# EAGLE design pastovac_2 (EAGLE 9.6.2)
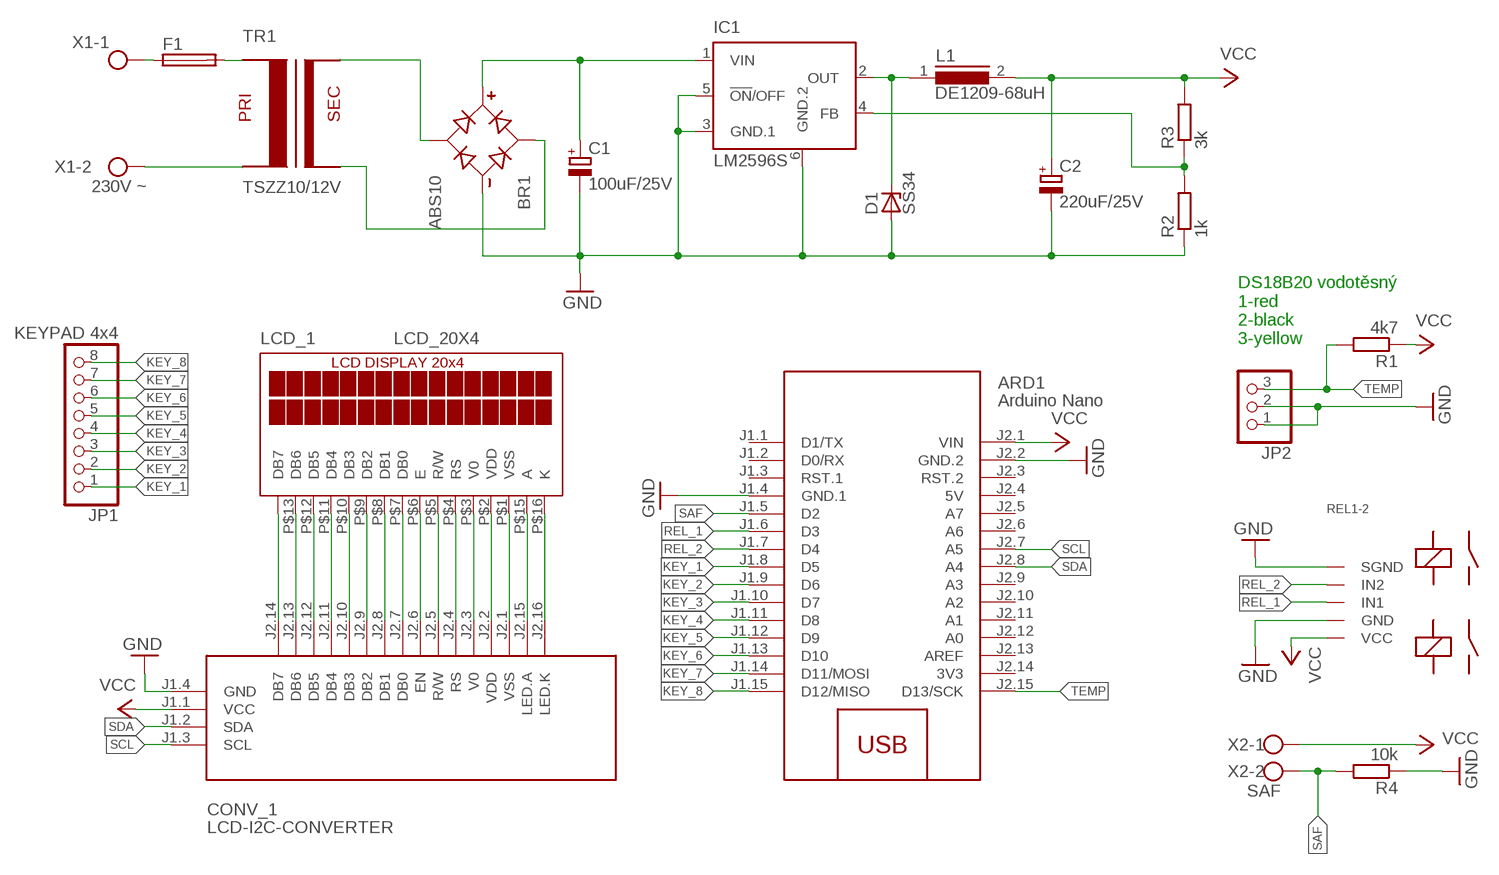
[diagram p0: schematic, sheet 1]

## Parts
ARD1  Arduino Nano  ARDUINO-NANO-3.0  [ARDUINO-NANO-3.0]
BR1  ABS10  [SOT200P640X160-4N]
C1  100uF/25V  CPOL-EU140CLH-0810  [140CLH-0810]
C2  220uF/25V  CPOL-EU140CLH-0810  [140CLH-0810]
CONV_1  LCD-I2C-CONVERTER  [LCD-I2C-CONVERTER]
D1  SS34  SMAJ5.0A  [DO214AC]
F1  FUSEBLANK_5X20MM  [FUSE_HOLDER_5X20MM]
IC1  LM2596S  [TO263-5]
JP1  KEYPAD 4x4  PINHD-1X8  [1X08]
JP2  PINHD-1X3  [1X03]
L1  DE1209-68uH  DR127  [DR127]
LCD_1  LCD_20X4  [LCD_20X4]
R1  4k7  R-EU_M1206  [M1206]
R2  1k  R-EU_M1206  [M1206]
R3  3k  R-EU_M1206  [M1206]
R4  10k  R-EU_M1206  [M1206]
REL1-2  RELAY-2-5V-30A  [RELAY-2-5V-30A]
TR1  TSZZ10/12V  TSZZ12/007M  [TSZZ12/007M]
X1  230V ~  W237-102  [W237-102]
X2  SAF  W237-102  [W237-102]

## Nets
GND: ARD1.J1.4(GND.1) ARD1.J2.2(GND.2) BR1.4(-) C1.- C2.- CONV_1.J1.4(GND) D1.A IC1.3(GND.1) IC1.5(!ON!/OFF) IC1.6(GND.2) JP2.1 JP2.2 R2.1 R4.1 REL1-2.GND REL1-2.SGND
KEY_1: ARD1.J1.8(D5) JP1.1
KEY_2: ARD1.J1.9(D6) JP1.2
KEY_3: ARD1.J1.10(D7) JP1.3
KEY_4: ARD1.J1.11(D8) JP1.4
KEY_5: ARD1.J1.12(D9) JP1.5
KEY_6: ARD1.J1.13(D10) JP1.6
KEY_7: ARD1.J1.14(D11/MOSI) JP1.7
KEY_8: ARD1.J1.15(D12/MISO) JP1.8
N$1: CONV_1.J2.14(DB7) LCD_1.P$14(DB7)
N$2: CONV_1.J2.13(DB6) LCD_1.P$13(DB6)
N$3: CONV_1.J2.12(DB5) LCD_1.P$12(DB5)
N$4: CONV_1.J2.11(DB4) LCD_1.P$11(DB4)
N$5: CONV_1.J2.10(DB3) LCD_1.P$10(DB3)
N$6: CONV_1.J2.9(DB2) LCD_1.P$9(DB2)
N$7: CONV_1.J2.8(DB1) LCD_1.P$8(DB1)
N$8: CONV_1.J2.7(DB0) LCD_1.P$7(DB0)
N$9: CONV_1.J2.6(EN) LCD_1.P$6(E)
N$10: CONV_1.J2.5(R/W) LCD_1.P$5(R/W)
N$11: CONV_1.J2.4(RS) LCD_1.P$4(RS)
N$12: CONV_1.J2.3(V0) LCD_1.P$3(V0)
N$13: CONV_1.J2.2(VDD) LCD_1.P$2(VDD)
N$14: CONV_1.J2.1(VSS) LCD_1.P$1(VSS)
N$15: CONV_1.J2.15(LED.A) LCD_1.P$15(A)
N$16: CONV_1.J2.16(LED.K) LCD_1.P$16(K)
N$17: D1.C IC1.2(OUT) L1.1
N$18: BR1.1(AC1) TR1.P$4
N$20: IC1.4(FB) R2.2 R3.1
N$22: TR1.P$2 X1.2
N$23: F1.2 TR1.P$1
N$24: BR1.3(+) C1.+ IC1.1(VIN)
N$25: F1.1 X1.1
N$26: BR1.2(AC2) TR1.P$3
REL_1: ARD1.J1.6(D3) REL1-2.IN2(IN1)
REL_2: ARD1.J1.7(D4) REL1-2.IN1(IN2)
SAF: ARD1.J1.5(D2) R4.2 X2.2
SCL: ARD1.J2.7(A5) CONV_1.J1.3(SCL)
SDA: ARD1.J2.8(A4) CONV_1.J1.2(SDA)
TEMP: ARD1.J2.15(D13/SCK) JP2.3 R1.2
VCC: ARD1.J2.1(VIN) C2.+ CONV_1.J1.1(VCC) L1.2 R1.1 R3.2 REL1-2.VCC X2.1
Unconnected: ARD1.J1.1(D1/TX) ARD1.J1.2(D0/RX) ARD1.J1.3(RST.1) ARD1.J2.3(RST.2) ARD1.J2.5(A7) ARD1.J2.6(A6) ARD1.J2.9(A3) ARD1.J2.10(A2) ARD1.J2.11(A1) ARD1.J2.12(A0) ARD1.J2.13(AREF)

## Notes on the sheet
- DS18B20 vodotěsný
  1-red
  2-black
  3-yellow

## Power pins joined to a net without a drawn wire
3V3: ARD1.J2.14(3V3)
5V: ARD1.J2.4(5V)

## Library data of the parts
ARD1 = diy-modules:ARDUINO-NANO-3.0: Arduino Nano 3.0 and compatible devices More details available here: https://www.arduino.cc/en/Main/ArduinoBoardNano Click here to find device on ebay.com <http://www.ebay.com/sch/arduino+nano>
BR1 = ABS10:ABS10: Surface Mount Si-Bridge-Rectifiers with 4mm Pitch 700V input 1000V reverse Check prices <https://pricing.snapeda.com/parts/ABS10/Diotec%20Semiconductor/view-part?ref=eda>; AVAILABILITY: Bad; DESCRIPTION: 32,768 kHz ± 20 ppm Crystal 9pF 70 kOhms 2-SMD, bez olova; MF: Diotec Semiconductor; MP: ABS10; PACKAGE: SMD-2 Diotec Semiconductor; PRICE: None
C1 C2 = resistor:CPOL-EU: POLARIZED CAPACITOR, European symbol
CONV_1 = diy-modules:LCD-I2C-CONVERTER: I2C Bus to 4-Bit Parallel LCD Interface with LED backlight driver
D1 = smaj_10:SMAJ*A: SMAJ Series TVS Diodes Source: http://www.littelfuse.com/~/media/electronics/datasheets/tvs_diodes/littelfuse_tvs_diode_smaj_datasheet.pdf.pdf; MF: Littelfuse; MPN: SMAJ5.0A; OC_FARNELL: 1827607; OC_NEWARK: 71J2029
F1 = fuse:FUSE: Fuse; OC_FARNELL: unknown; OC_NEWARK: unknown
IC1 = national-semiconductor:LM2596: SIMPLE SWITCHER® Power Converter 150 kHz 3A Step-Down Voltage Regulator Source: http://www.national.com/ds/LM/LM2596.pdf; MF: NATIONAL SEMICONDUCTOR; MPN: LM2596S-ADJ/NOPB; OC_FARNELL: 9494367; OC_NEWARK: 41K3842
JP1 = pinhead:PINHD-1X8: PIN HEADER
JP2 = pinhead:PINHD-1X3: PIN HEADER
L1 = inductors:DR127: High Power Density, High Efficiency, Shielded Inductors Source: coiltronics_dr_series.pdf
LCD_1 = display-lcd2:LCD_20X4: Tuxgraphics LCD display 16x2 characters reflective, without background light Source: tuxgr_12x2_r2.pdf
R1-R4 = resistor:R-EU_: RESISTOR, European symbol
REL1-2 = Arduino-clone:RELAY-2-5V-30A
TR1 = pastovac_2:TSZZ12/007M: TSZZ12/007M
X1 X2 = con-wago-500:W237-102: WAGO SCREW CLAMP; MPN: 237-102; OC_FARNELL: unknown; OC_NEWARK: 70K9898

## Net classes
0 default: clearance 0.205 mm

## Board
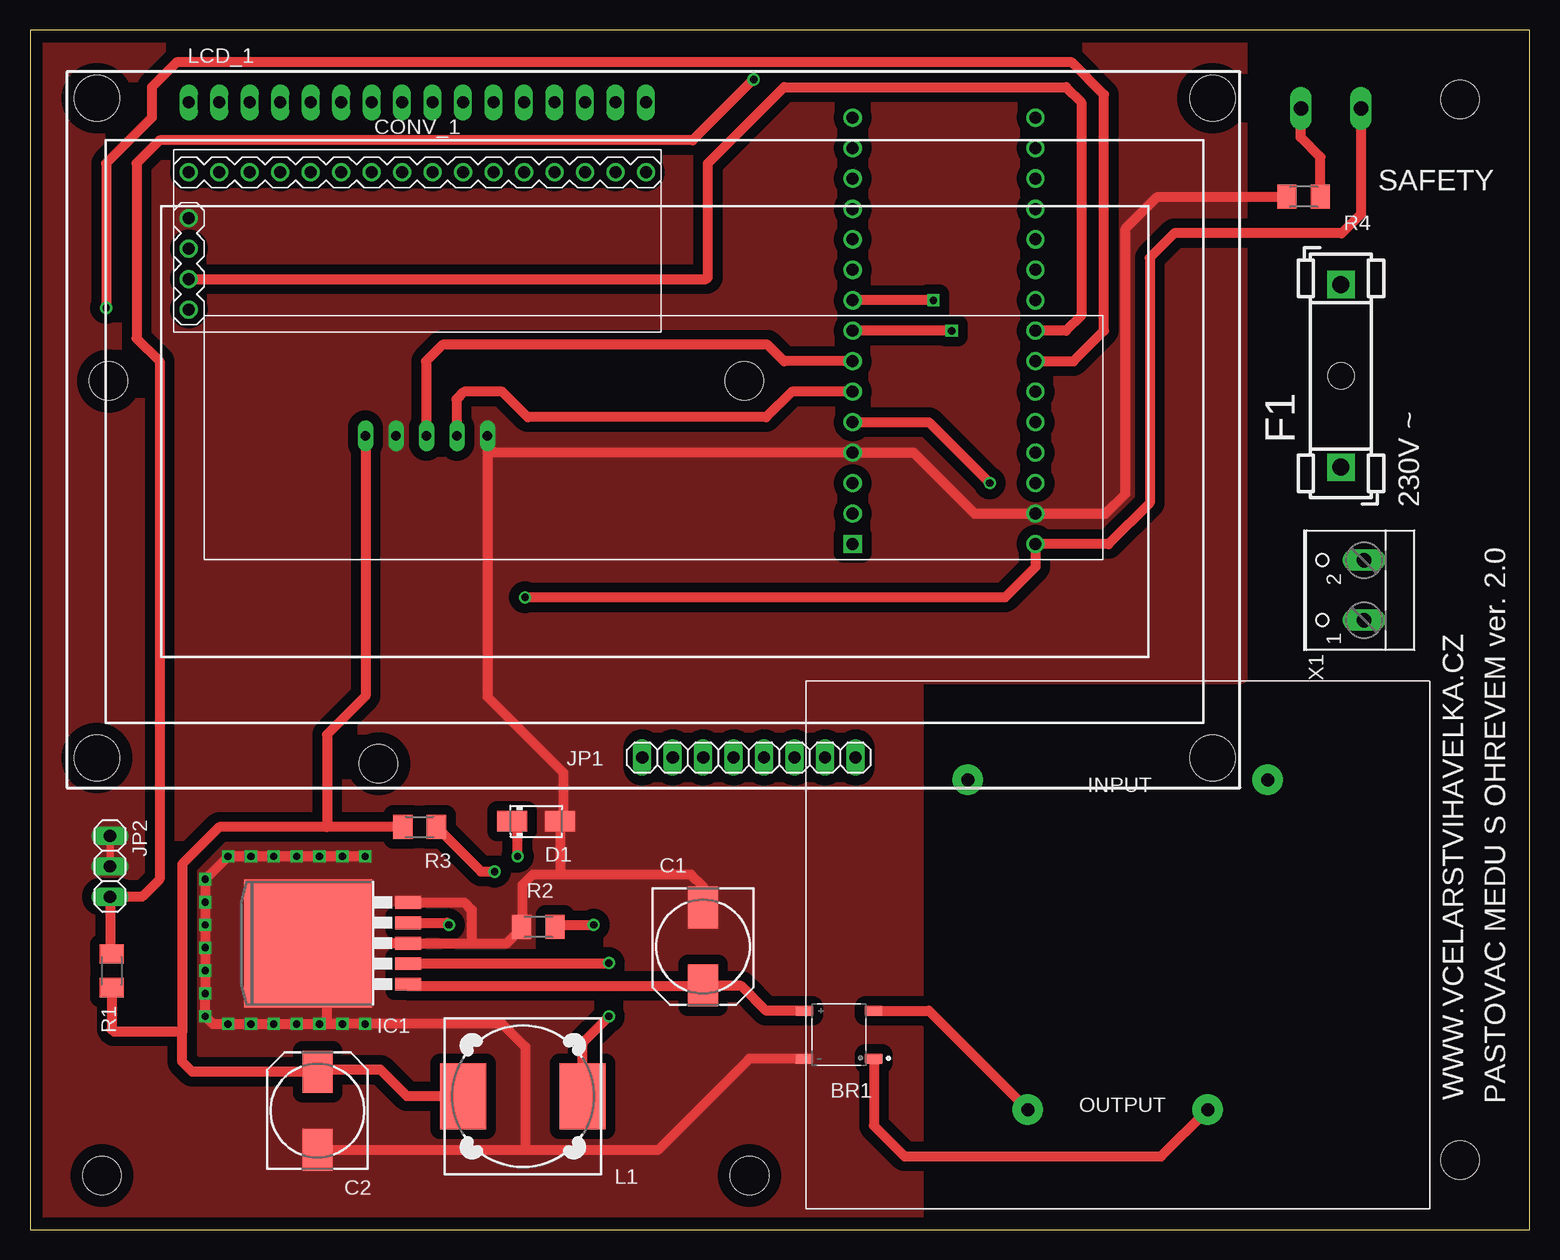
[diagram p1: board, top side]
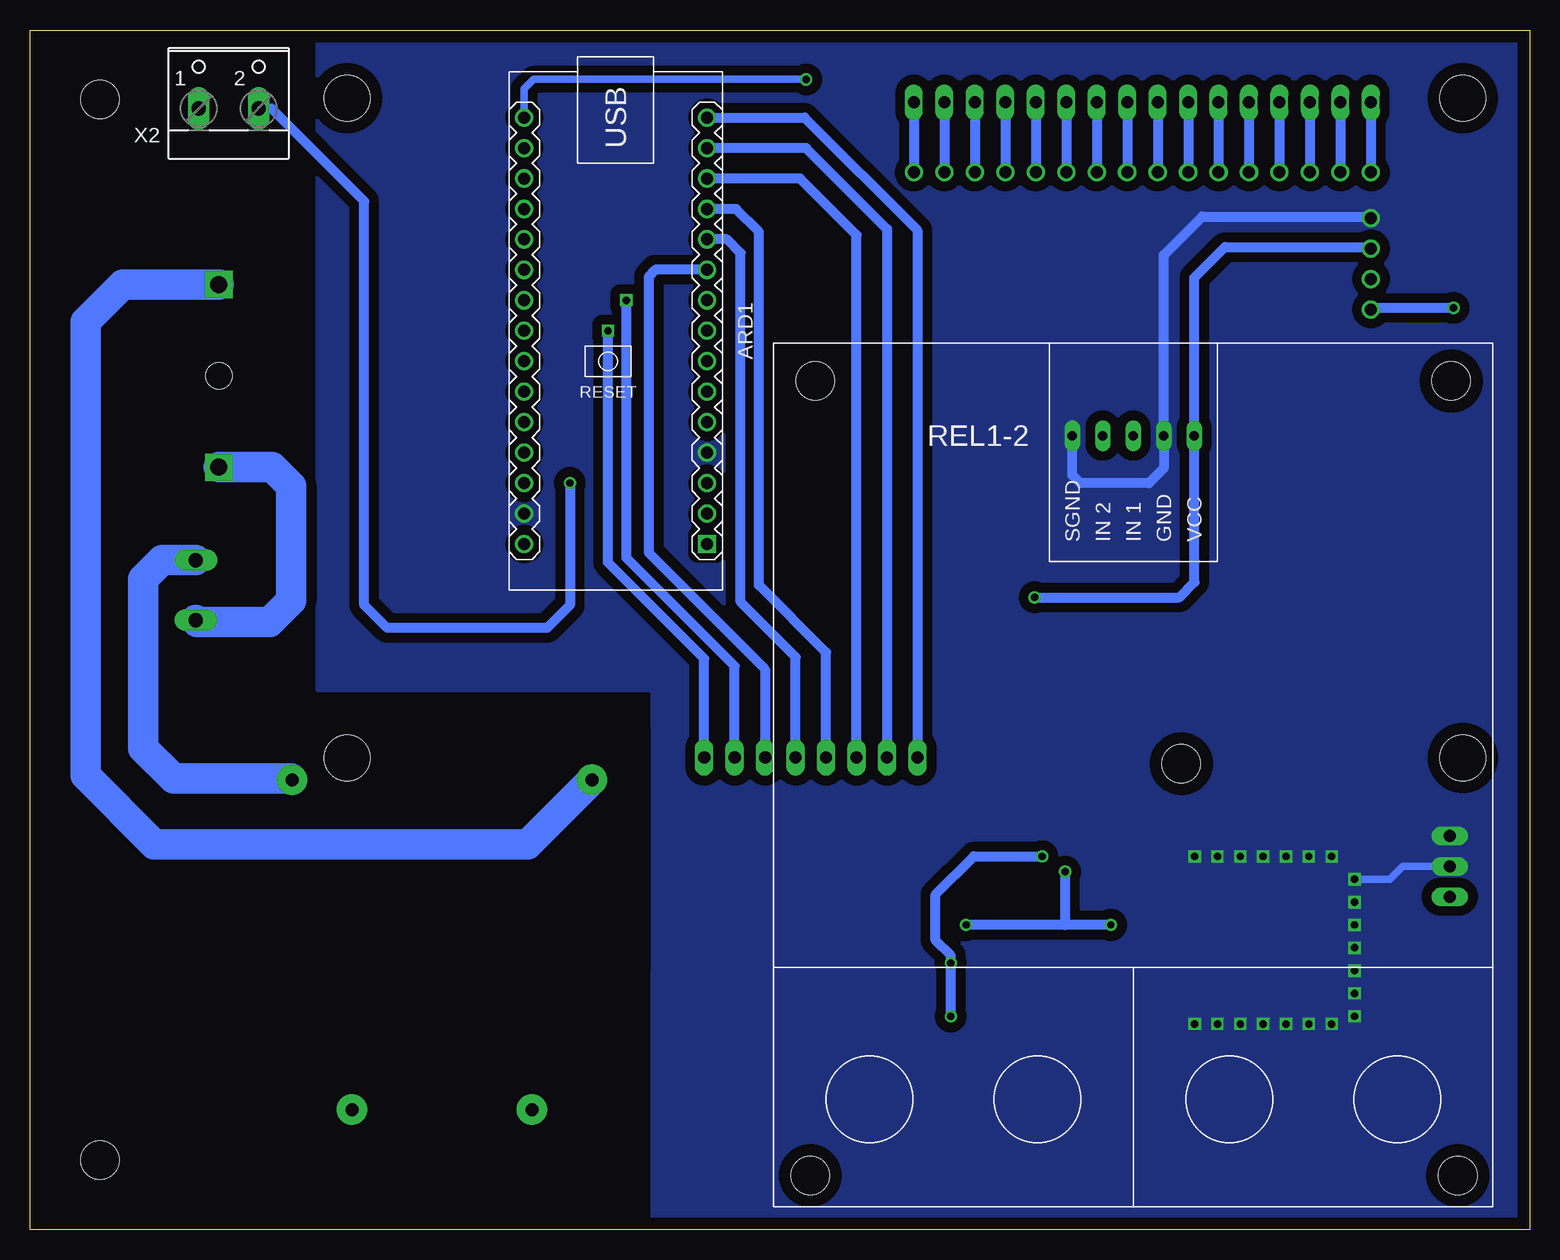
[diagram p2: board, bottom side, seen from below]

Size 125.02 x 100.01 mm. Coordinates in mm from the lower left corner, seen from the top.
Outline: 0,0 125.02,0.01 125.02,100.01 0,100 0,0
Copper layers (1*16): Top 0.035mm / dielectric 1.5mm / Bottom 0.035mm
Design rules "default *": minimum track width 24mil, minimum drill 24mil, track to track 20mil, track to pad 20mil, pad to pad 20mil, via to via 20mil, smd to smd 20mil, copper to edge 40mil, drill to drill 20mil, minimum pad ring 10mil, minimum via ring 8mil, stop-mask expansion 4mil, vias tented up to drill 0mil, thermal gap 10mil
Holes 3.2 mm at 119.2,5.8 119.2,94.2 6,4.5 59.98,4.5

### Footprints (pad centres in the part's own frame; a part is rotated, then mirrored left to right if it is on the bottom)
ARDUINO-NANO-3.0 = drill 1 square: J1.1 17.78,7.62 | drill 1: J1.2 15.24,7.62; J1.3 12.7,7.62; J1.4 10.16,7.62; J1.5 7.62,7.62; J1.6 5.08,7.62; J1.7 2.54,7.62; J1.8 0,7.62; J1.9 -2.54,7.62; J1.10 -5.08,7.62; J1.11 -7.62,7.62; J1.12 -10.16,7.62; J1.13 -12.7,7.62; J1.14 -15.24,7.62; J1.15 -17.78,7.62; J2.1 17.78,-7.62; J2.2 15.24,-7.62; J2.3 12.7,-7.62; J2.4 10.16,-7.62; J2.5 7.62,-7.62; J2.6 5.08,-7.62; J2.7 2.54,-7.62; J2.8 0,-7.62; J2.9 -2.54,-7.62; J2.10 -5.08,-7.62; J2.11 -7.62,-7.62; J2.12 -10.16,-7.62; J2.13 -12.7,-7.62; J2.14 -15.24,-7.62; J2.15 -17.78,-7.62
SOT200P640X160-4N = smd 1.52 x 0.84: 1 -2.9,2; 2 -2.9,-2; 3 2.9,-2; 4 2.9,2
140CLH-0810 = smd 3.5 x 2.5: + 3.25,0; - -3.25,0
LCD-I2C-CONVERTER = drill 1: J1.1 -19.05,0; J1.2 -19.05,-2.54; J1.3 -19.05,-5.08; J1.4 -19.05,2.54; J2.1 19.05,6.35; J2.2 16.51,6.35; J2.3 13.97,6.35; J2.4 11.43,6.35; J2.5 8.89,6.35; J2.6 6.35,6.35; J2.7 3.81,6.35; J2.8 1.27,6.35; J2.9 -1.27,6.35; J2.10 -3.81,6.35; J2.11 -6.35,6.35; J2.12 -8.89,6.35; J2.13 -11.43,6.35; J2.14 -13.97,6.35; J2.15 -16.51,6.35; J2.16 -19.05,6.35
DO214AC = smd 2.5 x 1.7: A 2,0; C -2,0
FUSE_HOLDER_5X20MM = drill 1.422 pad 2.286 square: 1 0,0; 2 15.24,0 | hole 2.2: 7.62,0
TO263-5 = smd 1.067 x 2.159: 1 -3.404,-5.791; 2 -1.702,-5.791; 3 0,-5.791; 4 1.702,-5.791; 5 3.404,-5.791 | smd 10.668 x 10.668: 6 0,2.54
1X08 = drill 1.016 long: 1 -8.89,0; 2 -6.35,0; 3 -3.81,0; 4 -1.27,0; 5 1.27,0; 6 3.81,0; 7 6.35,0; 8 8.89,0
1X03 = drill 1.016 long: 1 -2.54,0; 2 0,0; 3 2.54,0
DR127 = smd 3.85 x 5.5: 1 -4.975,0; 2 4.975,0
LCD_20X4 = drill 1 long: P$1 48.26,57.15; P$2 45.72,57.15; P$3 43.18,57.15; P$4 40.64,57.15; P$5 38.1,57.15; P$6 35.56,57.15; P$7 33.02,57.15; P$8 30.48,57.15; P$9 27.94,57.15; P$10 25.4,57.15; P$11 22.86,57.15; P$12 20.32,57.15; P$13 17.78,57.15; P$14 15.24,57.15; P$15 12.7,57.15; P$16 10.16,57.15 | hole 3.81: 2.5,2.5; 95.5,2.5; 2.5,57.5; 95.5,57.5
M1206 = smd 1.6 x 2: 1 -1.4,0; 2 1.4,0
RELAY-2-5V-30A = drill 0.8 long: GND -7.66,-2.54; IN1 -7.66,0; IN2 -7.66,2.54; SGND -7.66,5.08; VCC -7.66,-5.08 | hole 3.2: -3.1,26.5; -3.1,-26.5; -35,-4
TSZZ12/007M = drill 1.1 pad 2.54: P$1 -13.75,-12.5; P$2 -13.75,12.5; P$3 13.75,-7.5; P$4 13.75,7.5
W237-102 = drill 1.194 long: 1 -2.5,-1.27; 2 2.5,-1.27

### Placement (x,y rotation side)
ARD1  76.2,74.93 270 bottom
BR1  67.44,16.26 180 top
C1  56.1,23.6 270 top
C2  23.96,9.92 90 top
CONV_1  32.29,81.79 0 top
D1  42.2,34.04 0 top
F1  109.28,63.56 90 top
IC1  25.73,23.87 90 top
JP1  59.93,39.35 180 top
JP2  6.67,30.29 270 top
L1  41.09,11.12 180 top
LCD_1  3.08,36.83 0 top
R1  6.81,21.58 90 top
R2  42.38,25.23 0 top
R3  32.48,33.57 180 top
R4  106.17,86.11 0 top
REL1-2  33.05,73.84 90 bottom
TR1  90.68,23.75 270 top
X1  109.94,53.3 90 top
X2  108.46,94.74 0 bottom

### Tracks (layer width: path | path; a pad name or v marks a point on that pad's centre or on a via)
GND  (via drill 0.61)
  Top 0.61: JP2.1 JP2.2
  Top 0.813: 24.26,23.87 IC1.3 36.83,23.87 | 24.26,23.87 24.13,24 | 36.83,23.87 39.75,23.87 40.98,25.1 | 40.98,25.1 R2.1 41.02,25.28 41.02,28.7 41.91,29.59 44.58,29.59 | 40.64,25.44 40.98,25.1 | IC1.5 36.22,27.28 36.83,26.67 36.83,23.87 | C2.- 41.27,6.67 | 41.27,6.67 52.39,6.67 59.98,14.26 BR1.4 | v26.04,17.14 v27.94,17.14 39.37,17.14 41.27,15.24 41.27,6.67 | v26.04,17.14 24.77,17.14 24.77,23.36 24.26,23.87 | REL1-2.SGND 38.13,64.77 | 38.13,64.77 38.13,44.42 44.45,38.1 44.45,34.29 D1.A 44.2,29.97 44.58,29.59 | 38.13,64.77 ARD1.J1.4 73.66,64.77 78.74,59.69 ARD1.J2.2 89.66,59.69 91.31,61.34 91.31,83.44 93.98,86.11 R4.1 | C1.- 56.1,28.61 55.12,29.59 44.58,29.59 | v27.94,31.11 v26.04,31.11 v24.13,31.11 v22.23,31.11 v20.32,31.11 v18.41,31.11 v16.51,31.11 v14.61,29.21 v14.61,27.3 v14.61,25.4 v14.61,23.5 v14.61,21.59 v14.61,19.68 v14.61,17.78 15.24,17.14 v16.51,17.14 v18.41,17.14 v20.32,17.14 v22.23,17.14 v24.13,17.14 v26.04,17.14
  Top 1.016: 24.63,23.87 24.5,24 | 24.5,24 24.5,24.63 27.18,27.3 | IC1.6 23.19,24 24.13,24 24.5,24
  Bottom 0.61: JP2.2 10.6,30.29 11.68,29.21 v14.61,29.21
  Bottom 0.813: CONV_1.J1.4 13.37,84.45 27.3,84.45 30.51,81.25 REL1-2.GND 30.51,63.47 31.75,62.23 37.47,62.23 38.13,62.9 REL1-2.SGND
  pour Top (isolate 0.813, no thermals): 0,0 74,0 74,46 101,46 101,100 0,100
  pour Bottom (isolate 0.813, no thermals): 1,1 73.09,1 73.03,41.91 73.09,41.98 73.09,45 101,45 101,99 1,99
KEY_1  (via drill 0.6)
  Top 0.813: v76.83,74.93 ARD1.J1.8
  Bottom 0.813: JP1.1 68.82,47.61 76.83,55.63 v76.83,74.93
KEY_2  (via drill 0.6)
  Top 0.813: v75.31,77.47 ARD1.J1.9
  Bottom 0.813: JP1.2 66.28,46.97 75.31,56.01 v75.31,77.47
KEY_3
  Bottom 0.813: ARD1.J1.10 72.9,80.01 73.41,79.5 73.41,56.39 63.75,46.74 63.75,39.37 JP1.3
KEY_4
  Bottom 0.813: JP1.4 61.2,47.74 65.79,52.32 65.79,81.41 66.93,82.55 ARD1.J1.11
KEY_5
  Bottom 0.813: JP1.5 58.66,48.12 64.26,53.72 64.26,83.19 66.17,85.09 ARD1.J1.12
KEY_6
  Bottom 0.813: JP1.6 56.12,82.92 60.83,87.63 ARD1.J1.13
KEY_7
  Bottom 0.813: ARD1.J1.14 60.33,90.17 53.58,83.42 JP1.7
KEY_8
  Bottom 0.813: ARD1.J1.15 60.45,92.71 51.05,83.31 51.05,39.37 JP1.8
N$1
  Bottom 0.813: LCD_1.P$14 CONV_1.J2.14
N$2
  Bottom 0.813: LCD_1.P$13 CONV_1.J2.13
N$3
  Bottom 0.813: LCD_1.P$12 CONV_1.J2.12
N$4
  Bottom 0.813: LCD_1.P$11 CONV_1.J2.11
N$5
  Bottom 0.813: LCD_1.P$10 CONV_1.J2.10
N$6
  Bottom 0.813: LCD_1.P$9 CONV_1.J2.9
N$7
  Bottom 0.813: LCD_1.P$8 CONV_1.J2.8
N$8
  Bottom 0.813: LCD_1.P$7 CONV_1.J2.7
N$9
  Bottom 0.813: LCD_1.P$6 CONV_1.J2.6
N$10
  Bottom 0.813: LCD_1.P$5 CONV_1.J2.5
N$11
  Bottom 0.813: LCD_1.P$4 CONV_1.J2.4
N$12
  Bottom 0.813: LCD_1.P$3 CONV_1.J2.3
N$13
  Bottom 0.813: LCD_1.P$2 CONV_1.J2.2
N$14
  Bottom 0.813: LCD_1.P$1 CONV_1.J2.1
N$15
  Bottom 0.813: LCD_1.P$15 CONV_1.J2.15
N$16
  Bottom 0.813: LCD_1.P$16 CONV_1.J2.16
N$17  (via drill 0.61)
  Top 0.813: L1.1 46.06,15.58 v48.26,17.78 | v48.26,22.23 48.21,22.17 IC1.2 | v40.64,31.11 40.64,33.6 D1.C
  Top 1.016: 45.9,11.28 L1.1 | D1.C
  Bottom 0.813: v48.26,17.78 v48.26,22.23 48.26,22.86 49.53,24.13 49.53,27.94 46.35,31.11 v40.64,31.11
N$18
  Top 0.813: BR1.1 70.34,8.66 72.9,6.1 94.28,6.1 TR1.P$4
N$20  (via drill 0.61)
  Top 0.813: IC1.4 34.75,25.58 v34.92,25.4 | v46.99,25.4 46.95,25.36 43.9,25.36 | R3.1 37.6,29.84 v38.73,29.84
  Top 1.016: 43.9,25.36 R2.2
  Bottom 0.813: v34.92,25.4 38.73,25.4 | 38.73,25.4 v46.99,25.4 | v38.73,29.84 38.73,25.4
N$22
  Bottom 2.54: X1.2 114,55.8 115.57,54.23 115.57,40.13 113.03,37.59 103.27,37.59 TR1.P$2
N$23
  Bottom 2.54: F1.2 117.29,78.8 120.4,75.69 120.4,37.85 114.68,32.13 83.55,32.13 TR1.P$1
N$24
  Top 0.813: 31.59,20.4 31.67,20.32 56.06,20.32 C1.+ 56.13,20.32 59.31,20.32 61.37,18.26 BR1.3
  Top 1.016: IC1.1 31.59,20.4
N$25
  Bottom 2.54: F1.1 104.83,63.56 103.25,61.98 103.25,52.45 105.03,50.67 111.08,50.67 X1.1
N$26
  Top 0.813: BR1.2 74.92,18.26 TR1.P$3
REL_1
  Top 0.813: ARD1.J1.6 63.5,69.85 61.37,67.72 41.5,67.72 39.37,69.85 36.2,69.85 35.56,69.22 35.56,66.22 REL1-2.IN2
REL_2
  Top 0.813: ARD1.J1.7 62.87,72.39 61.49,73.77 34.4,73.77 33.02,72.39 33.02,66.22 REL1-2.IN1
SAF  (via drill 0.61)
  Top 0.813: ARD1.J1.5 74.93,67.31 v80.01,62.23 | R4.2 107.57,89.41 105.92,91.06 105.92,93.43 X2.2
  Bottom 0.813: v80.01,62.23 80.01,52.07 81.92,50.16 95.25,50.16 97.16,52.07 97.16,85.72 104.9,93.47 X2.2
SCL  (via drill 0.61)
  Top 0.813: v6.35,76.83 6.35,88.9 10.16,92.71 10.16,95.25 12.22,97.31 86.84,97.31 89.53,94.61 89.53,74.93 87,72.39 ARD1.J2.7
  Bottom 0.813: v6.35,76.83 13.11,76.83 CONV_1.J1.3
SDA
  Top 0.813: CONV_1.J1.2 56.39,79.25 56.52,79.38 56.52,88.9 62.87,95.25 86.36,95.25 87.63,93.98 87.63,76.2 86.36,74.93 ARD1.J2.8
TEMP  (via drill 0.61)
  Top 0.813: R1.2 6.67,23.12 JP2.3 9.34,27.75 10.79,29.21 10.79,72.39 8.89,74.3 8.89,88.9 10.79,90.81 55.24,90.81 v60.33,95.89
  Bottom 0.61: v60.33,95.89 83.06,95.89 83.82,95.12 ARD1.J2.15
VCC  (via drill 0.61)
  Top 0.813: L1.2 31.43,11.12 29.21,13.34 23.5,13.34 23.66,13.17 C2.+ 13.5,13.17 12.7,13.97 12.7,16.51 | R1.1 6.81,16.69 6.99,16.51 12.7,16.51 | R3.2 24.77,33.57 | 24.77,33.57 15.79,33.57 12.7,30.48 12.7,16.51 | REL1-2.VCC 27.97,44.48 24.77,41.27 24.77,33.57 | v41.27,52.7 81.28,52.7 83.82,55.24 ARD1.J2.1 89.92,57.15 93.34,60.58 93.34,81.03 95.38,83.06 109.35,83.06 110.96,84.67 X2.1
  Top 1.016: 6.86,19.81 R1.1 | 35.81,11.43 L1.2
  Bottom 0.813: CONV_1.J1.1 13.37,81.92 25.4,81.92 27.97,79.34 REL1-2.VCC 27.94,66.15 27.94,53.98 29.21,52.7 v41.27,52.7

### Text on the board
tNames: SAFETY | 230V ~ | WWW.VCELARSTVIHAVELKA.CZ | PASTOVAC MEDU S OHREVEM ver. 2.0